# EasyEDA schematic 1-Schematic_Xmas-tree_EASYEDA.json
TITLE: Sheet_1; REV: 1.0; Date: 2022-12-02; Sheet: 1/1; Drawn By: Bibulle Martin; Company: Your Company
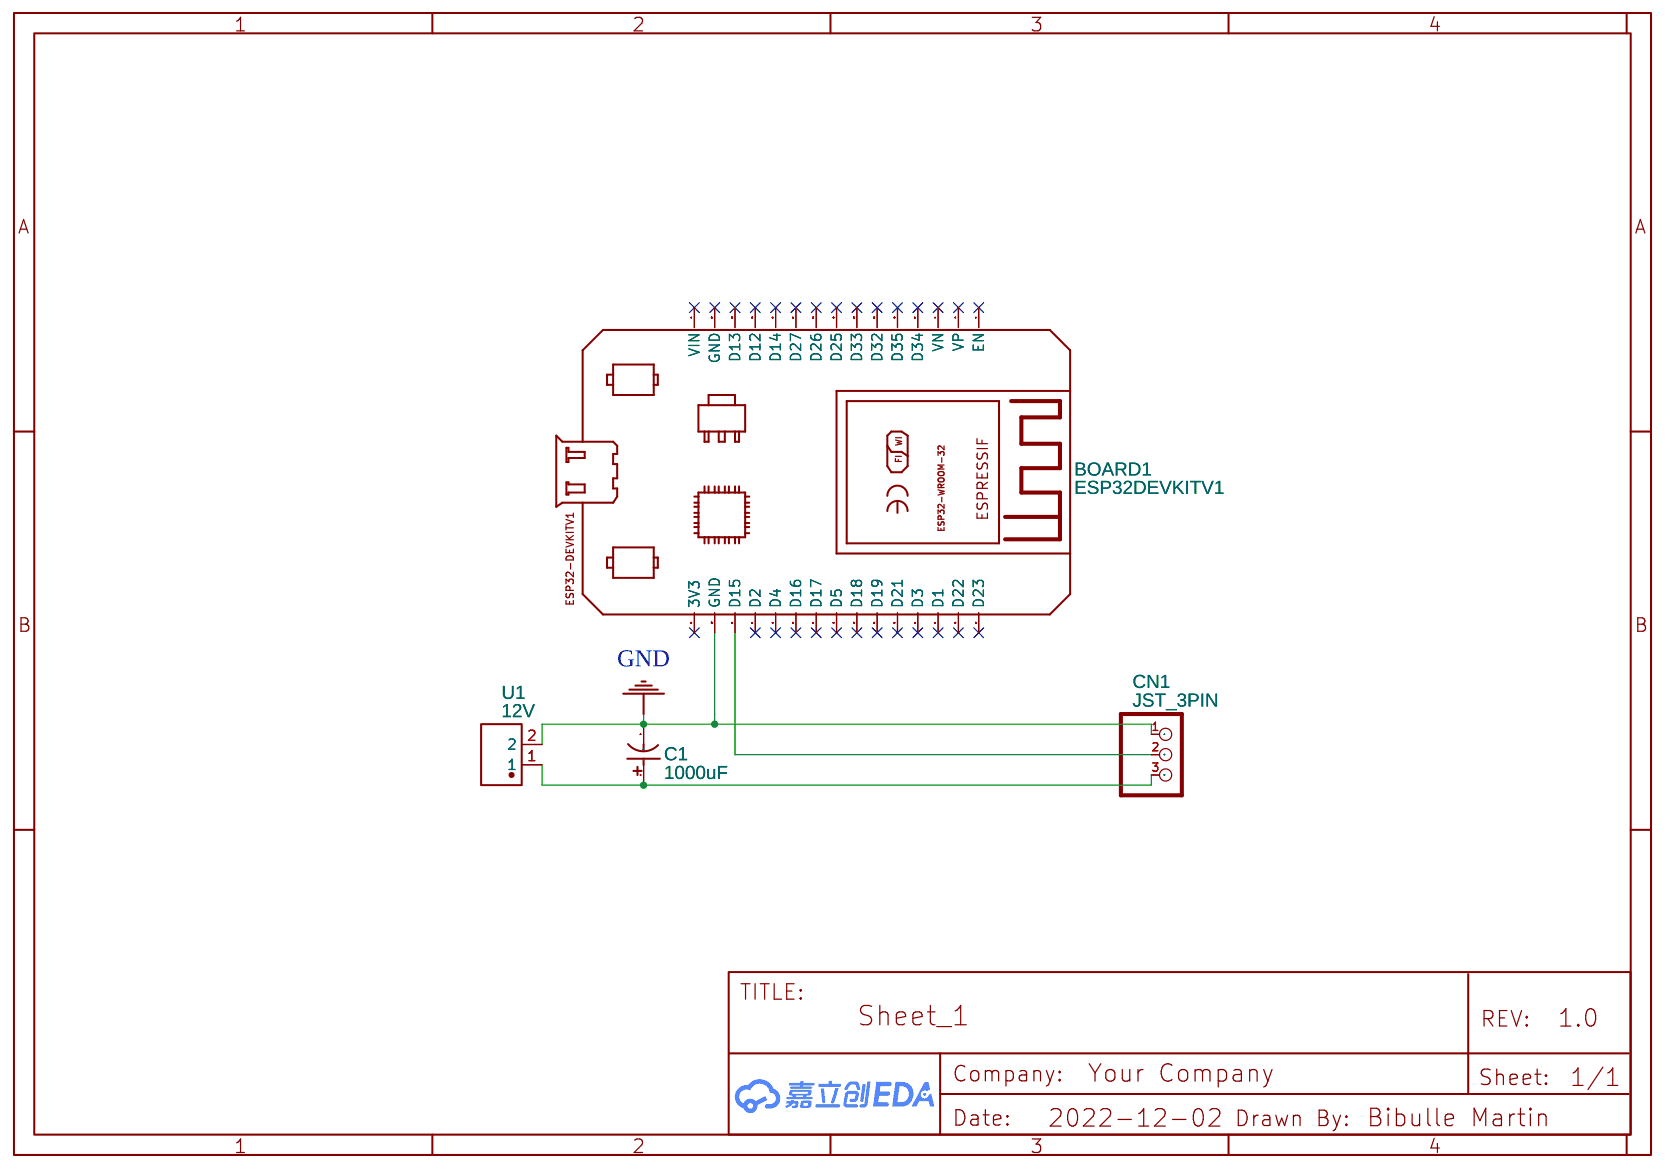
[diagram p0: schematic sheet]

## Parts
BOARD1  ESP32DEVKITV1  [ESP32-DEVKITV1]
C1  1000uF  [CAP-TH_BD8.0-P3.50-D0.5-FD]
CN1  JST_3PIN  [JSTPH3]
U1  12V  [CONN-TH_2P-P5.08_L8.5-W10.2]

## Library data of the parts
BOARD1 = ESP32DEVKITV1: Contributor: Sumeet Kumar
C1 = 1000uF 16V 8*16: Supplier: LCSC; Manufacturer: ValuePro; Supplier Part: C43832; JLCPCB Part Class: Extended Part
CN1 = JST_3PIN: Contributor: Adafruit
U1 = DB127V-5.0-2P: Supplier: LCSC; Supplier Part: C395885; Manufacturer: DIBO(地博电气); Manufacturer Part: DB127V-5.0-2P-GN-S; Contributor: LCSC; JLCPCB Part Class: Extended Part

## Nets
GND: BOARD1.GND@1(GND) C1.2 CN1.1 U1.2
Net-(BOARD1-D15): BOARD1.D15 CN1.2
Net-(C1-1): C1.1 CN1.3 U1.1

Not connected (* = marked no-connect by the designer): BOARD1 3V3* D1* D2* D3* D4* D5* D12* D13* D14* D16* D17* D18* D19* D21* D22* D23* D25* D26* D27* D32* D33* D34* D35* EN* GND* VIN* VN* VP*
